# EAGLE design cvtv (EAGLE 6.6.0)
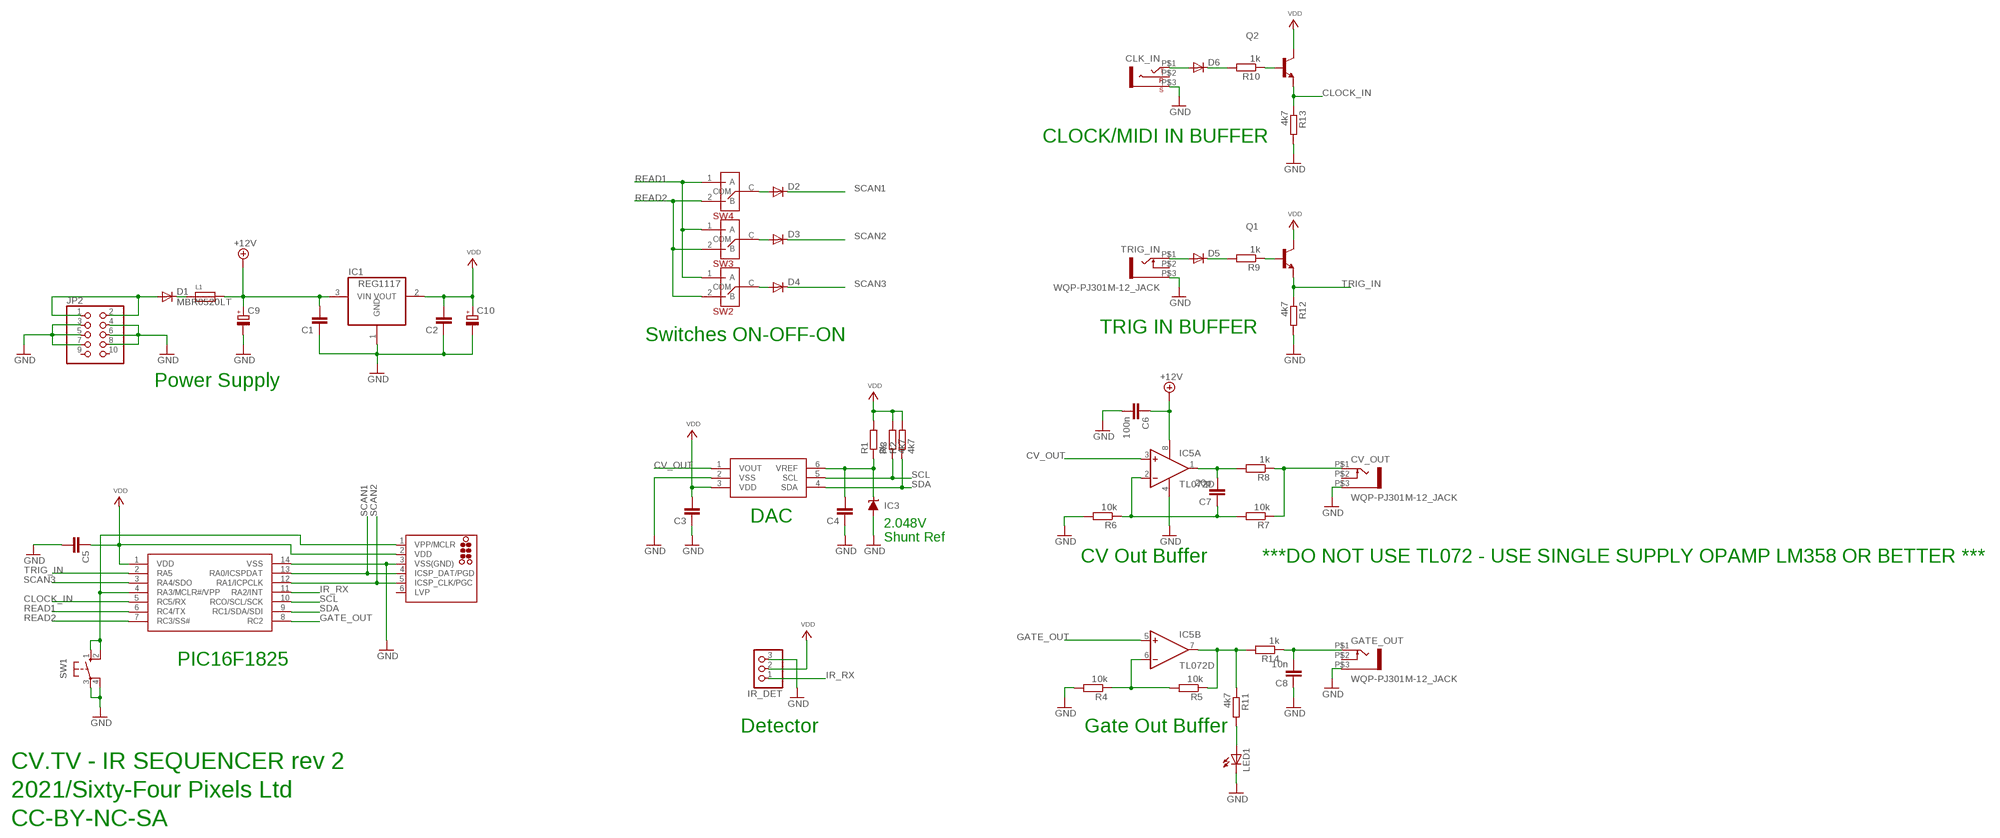
[diagram p0: schematic, sheet 1]

## Parts
C1  C-EUC0805  [C0805]
C2  C-EUC0805  [C0805]
C3  C-EUC0805  [C0805]
C4  C-EUC0805  [C0805]
C5  C-EUC0805  [C0805]
C6  100n  C-EUC0805  [C0805]
C7  20p  C-EUC0805  [C0805]
C8  10n  C-EUC0805  [C0805]
C9  CPOL-EUE2-5  [E2-5]
C10  CPOL-EUE2-5  [E2-5]
CLK_IN  THONKICONN_STEREO  [WQP-PJ301M-ST]
CV_OUT  WQP-PJ301M-12_JACK  [WQP-PJ301M-12_JACK]
D1  MBR0520LT  [SOD123]
D2  TS4148  [D0805]
D3  TS4148  [D0805]
D4  TS4148  [D0805]
D5  TS4148  [D0805]
D6  TS4148  [D0805]
GATE_OUT  WQP-PJ301M-12_JACK  [WQP-PJ301M-12_JACK]
IC1  REG1117  [SOT223]
IC2  PIC16F1825SO14  [SO14]
IC3  LM4041A12DBZ  [DBZ_R-PDSO-G3]
IC4  MCP4726  [SOT23-6]
IC5  TL072D  [SO08]
ICSP  TC2030-MCP-NL  [TC2030-MCP-NL]
IR_DET  PINHD-1X3  [1X03]
JP2  PINHD-2X5  [2X05]
L1  FERRITE  [0603]
LED1  LED3MM  [LED3MM]
Q1  MMBT3904LT1-NPN-SOT23-BEC  [SOT23-BEC]
Q2  MMBT3904LT1-NPN-SOT23-BEC  [SOT23-BEC]
R1  3k  R-EU_R0805  [R0805]
R2  4k7  R-EU_R0805  [R0805]
R3  4k7  R-EU_R0805  [R0805]
R4  10k  R-EU_R0805  [R0805]
R5  10k  R-EU_R0805  [R0805]
R6  10k  R-EU_R0805  [R0805]
R7  10k  R-EU_R0805  [R0805]
R8  1k  R-EU_R0805  [R0805]
R9  1k  R-EU_R0805  [R0805]
R10  1k  R-EU_R0805  [R0805]
R11  4k7  R-EU_R0805  [R0805]
R12  4k7  R-EU_R0805  [R0805]
R13  4k7  R-EU_R0805  [R0805]
R14  1k  R-EU_R0805  [R0805]
SW1  10-XX  [B3F-10XX]
SW2  MICRO-SPDT  [MICRO-SPDT]
SW3  MICRO-SPDT  [MICRO-SPDT]
SW4  MICRO-SPDT  [MICRO-SPDT]
TRIG_IN  WQP-PJ301M-12_JACK  [WQP-PJ301M-12_JACK]

## Nets
+12V: C1.2 C6.1 C9.+ IC1.3(VIN) IC5.8(P:V+) L1.2
CLOCK_IN: IC2.5(RC5/RX) Q2.E R13.1
CV_OUT: IC4.1(VOUT) IC5.3(A:+IN)
GATE_OUT: IC2.8(RC2) IC5.5(B:+IN)
GND: C1.1 C2.1 C3.1 C4.1 C5.2 C6.2 C8.1 C9.- C10.- CLK_IN.P$3(S) CV_OUT.P$3 GATE_OUT.P$3 IC1.1(GND) IC2.14(VSS) IC3.2(A) IC4.2(VSS) IC5.4(P:V-) ICSP.3(VSS(GND)) IR_DET.3 JP2.3 JP2.4 JP2.5 JP2.6 JP2.7 JP2.8 LED1.K(C) R4.2 R6.2 R12.2 R13.2 SW1.3(P) SW1.4(P1) TRIG_IN.P$3
IR_RX: IC2.11(RA2/INT) IR_DET.1
N$1: D1.A JP2.1 JP2.2
N$2: IC2.4(RA3/MCLR#/VPP) ICSP.1(VPP/MCLR) SW1.1(S) SW1.2(S1)
N$3: CLK_IN.P$1(T) D6.A
N$4: D1.C L1.1
N$5: LED1.A R11.2
N$6: C4.2 IC3.1(C) IC4.6(VREF) R1.1
N$7: D6.K(C) R10.2
N$9: Q2.B R10.1
N$10: D5.A TRIG_IN.P$1
N$11: D2.A SW4.C(COM)
N$12: D5.K(C) R9.2
N$13: IC5.7(B:OUT) R5.1 R11.1 R14.2
N$15: D3.A SW3.C(COM)
N$16: C8.2 GATE_OUT.P$1 R14.1
N$17: IC5.6(B:-IN) R4.1 R5.2
N$18: C7.1 IC5.2(A:-IN) R6.1 R7.2
N$19: CV_OUT.P$1 R7.1 R8.1
N$20: C7.2 IC5.1(A:OUT) R8.2
N$21: Q1.B R9.1
N$25: D4.A SW2.C(COM)
READ1: IC2.6(RC4/TX) SW2.1(A) SW3.1(A) SW4.1(A)
READ2: IC2.7(RC3/SS#) SW2.2(B) SW3.2(B) SW4.2(B)
SCAN1: D2.K(C) IC2.13(RA0/ICSPDAT) ICSP.4(ICSP_DAT/PGD)
SCAN2: D3.K(C) IC2.12(RA1/ICPCLK) ICSP.5(ICSP_CLK/PGC)
SCAN3: D4.K(C) IC2.3(RA4/SDO)
SCL: IC2.10(RCO/SCL/SCK) IC4.5(SCL) R3.1
SDA: IC2.9(RC1/SDA/SDI) IC4.4(SDA) R2.1
TRIG_IN: IC2.2(RA5) Q1.E R12.1
VDD: C2.2 C3.2 C5.1 C10.+ IC1.2(VOUT) IC2.1(VDD) IC4.3(VDD) ICSP.2(VDD) IR_DET.2 Q1.C Q2.C R1.2 R2.2 R3.2
Unconnected: CLK_IN.P$2(R) CV_OUT.P$2 GATE_OUT.P$2 ICSP.6(LVP) JP2.9 JP2.10 TRIG_IN.P$2

## Notes on the sheet
- CLOCK/MIDI IN BUFFER
- TRIG IN BUFFER
- Switches ON-OFF-ON
- Power Supply
- DAC
- 2.048V 
  Shunt Ref
- CV Out Buffer | ***DO NOT USE TL072 - USE SINGLE SUPPLY OPAMP LM358 OR BETTER ***
- PIC16F1825
- Detector | Gate Out Buffer
- CV.TV - IR SEQUENCER rev 2
- 2021/Sixty-Four Pixels Ltd
- CC-BY-NC-SA

## Library data of the parts
C1-C8 = resistor:C-EU: CAPACITOR, European symbol
C9 C10 = resistor:CPOL-EU: POLARIZED CAPACITOR, European symbol
CLK_IN = jason_eagle6:THONKICONN_STEREO
CV_OUT GATE_OUT TRIG_IN = thonkiconn:WQP-PJ301M-12_JACK
D1 = diode:MBR0520LT: SCHOTTKY BARRIER RECTIFIER Source: http://onsemi.com .. MBR0520LT1-D.pdf
D2-D6 = jason_eagle6:TS4148
IC1 = burr-brown:REG1117: 800mA and 1A Low Dropout (LDO) Positive Regulator 1.8V, 2.5V, 2.85V, 3.3V, 5V, and Adj; MPN: REG1117; OC_FARNELL: 1097566; OC_NEWARK: 14P6981
IC2 = jasons_stuff:PIC16F1825
IC3 = texas:LM4041: PRECISION MICROPOWER SHUNT VOLTAGE REFERENCE Source: http://focus.ti.com/lit/ds/slcs146e/slcs146e.pdf; MPN: LM4041A12IDBZR; OC_FARNELL: 1407949; OC_NEWARK: 58K5875
IC4 = jasons_stuff:MCP4726: I2C DAC 12BIT
IC5 = linear:TL072: OP AMP
ICSP = tag-connect:TC2030: TAG-CONNECT ICSP Connector Manufacturer: Tag-Connect <http://www.tag-connect.com> Cable for easy In-Circuit Serial Programming. Designed for Microchip ICD2, suitable for many others. Two variants - one "with legs" (for hands-free fit on PCB) and another "without legs" for quick programming. PAD Description 1 MCLR/Vpp 2 Vdd 3 GND 4 PGD (ISPDAT) 5 PGC (ISPCLK) 6 nc (used for LVP) ©2009 ROFA.cz - modified and updated by Robert Darlington ‹rdarlington@gmail.com›
IR_DET = pinhead:PINHD-1X3: PIN HEADER
JP2 = pinhead:PINHD-2X5: PIN HEADER
L1 = microbuilder:FERRITE: Ferrite Bead 0603 MMZ1608B121C - 120 Ohm, 600mA Ferrite Chip - Digikey: 445-2164-1-ND BK1608HW121-T - 120 Ohm, 600mA Ferrite Chip - Digikey: 587-1876-2-ND
LED1 = led:LED: LED OSRAM: - CHIPLED LG R971, LG N971, LY N971, LG Q971, LY Q971, LO R971, LY R971 LH N974, LH R974 LS Q976, LO Q976, LY Q976 LO Q996 - Hyper CHIPLED LW Q18S LB Q993, LB Q99A, LB R99A - SideLED LS A670, LO A670, LY A670, LG A670, LP A670 LB A673, LV A673, LT A673, LW A673 LH A674 LY A675 LS A676, LA A676, LO A676, LY A676, LW A676 LS A679, LY A679, LG A679 - Hyper Micro SIDELED® LS Y876, LA Y876, LO Y876, LY Y876 LT Y87S - SmartLED LW L88C, LW L88S LB L89C, LB L89S, LG L890 LS L89K, LO L89K, LY L89K LS L896, LA L896, LO L896, LY L896 - TOPLED LS T670, LO T670, LY T670, LG T670, LP T670 LSG T670, LSP T670, LSY T670, LOP T670, LYG T670 LG T671, LOG T671, LSG T671 LB T673, LV T673, LT T673, LW T673 LH T674 LS T676, LA T676, LO T676, LY T676, LB T676, LH T676, LSB T676, LW T676 LB T67C, LV T67C, LT T67C, LS T67K, LO T67K, LY T67K, LW E67C LS E67B, LA E67B, LO E67B, LY E67B, LB E67C, LV E67C, LT E67C LW T67C LS T679, LY T679, LG T679 LS T770, LO T770, LY T770, LG T770, LP T770 LB T773, LV T773, LT T773, LW T773 LH T774 LS E675, LA E675, LY E675, LS T675 LS T776, LA T776, LO T776, LY T776, LB T776 LHGB T686 LT T68C, LB T68C - Hyper Mini TOPLED® LB M676 - Mini TOPLED Santana® LG M470 LS M47K, LO M47K, LY M47K Source: http://www.osram.convergy.de LUXEON: - LUMILED® LXK2-PW12-R00, LXK2-PW12-S00, LXK2-PW14-U00, LXK2-PW14-V00 LXK2-PM12-R00, LXK2-PM12-S00, LXK2-PM14-U00 LXK2-PE12-Q00, LXK2-PE12-R00, LXK2-PE12-S00, LXK2-PE14-T00, LXK2-PE14-U00 LXK2-PB12-K00, LXK2-PB12-L00, LXK2-PB12-M00, LXK2-PB14-N00, LXK2-PB14-P00, LXK2-PB14-Q00 LXK2-PR12-L00, LXK2-PR12-M00, LXK2-PR14-Q00, LXK2-PR14-R00 LXK2-PD12-Q00, LXK2-PD12-R00, LXK2-PD12-S00 LXK2-PH12-R00, LXK2-PH12-S00 LXK2-PL12-P00, LXK2-PL12-Q00, LXK2-PL12-R00 Source: www.luxeon.com KINGBRIGHT: KA-3528ASYC Source: www.kingbright.com
Q1 Q2 = transistor-neu-to92:*-NPN-: NPN Transistror
R1-R14 = rcl:R-EU_: RESISTOR, European symbol
SW1 = switch-omron:10-XX: OMRON SWITCH; MPN: B3F-1000; OC_FARNELL: 176432; OC_NEWARK: 36M3542
SW2-SW4 = jason_eagle6:MICRO-SPDT

## Board
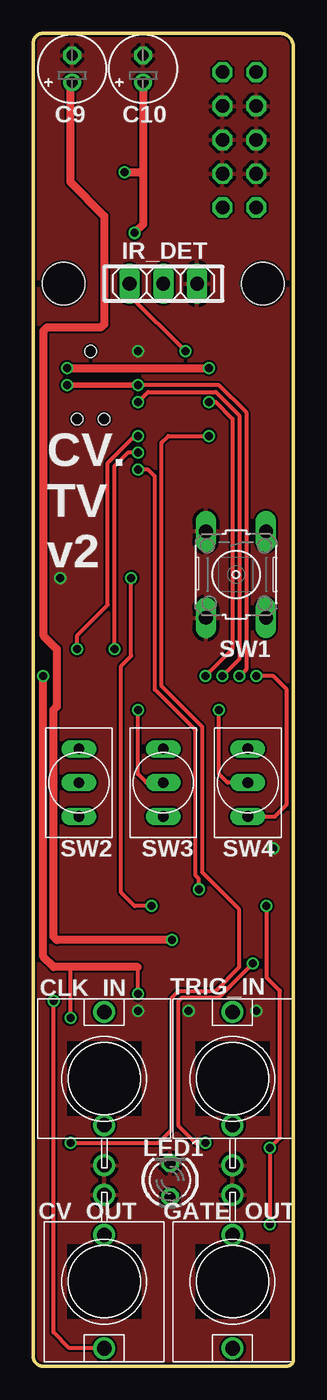
[diagram p1: board, top side]
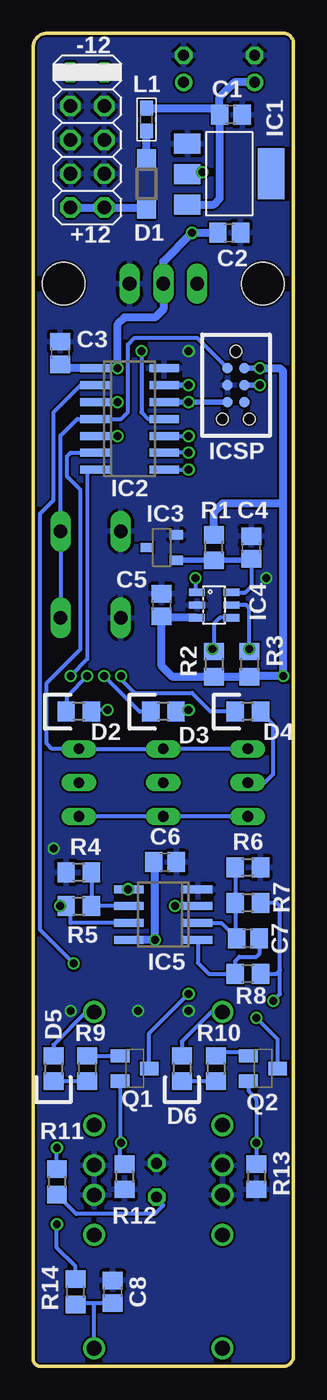
[diagram p2: board, bottom side, seen from below]

Size 19.56 x 100.08 mm. Coordinates in mm from the lower left corner, seen from the top.
Outline: 19.05,0 arc90 19.56,0.51 19.56,99.06 arc90 18.54,100.08 0.76,100.08 arc90 0,99.31 0,0.76 arc90 0.76,0 19.05,0
Copper layers (1*16): Top 0.035mm / dielectric 1.5mm / Bottom 0.035mm
Design rules "hackvana": minimum track width 6mil, minimum drill 0.3mm, track to track 6mil, track to pad 9mil, pad to pad 6mil, via to via 6mil, smd to smd 0mil, copper to edge 6mil, drill to drill 6mil, minimum pad ring 10mil, minimum via ring 6mil, stop-mask expansion 2mil, vias tented up to drill 100mil, thermal gap 10mil
Holes 3.2 mm at 17.27,81.28 2.29,81.28

### Footprints (pad centres in the part's own frame; a part is rotated, then mirrored left to right if it is on the bottom)
C0805 = smd 1.3 x 1.5: 1 -0.85,0; 2 0.85,0
E2-5 = drill 0.813 pad 1.27: + -1.016,0 | drill 0.813 pad 1.27 octagon: - 1.016,0
WQP-PJ301M-ST = drill 1.1: P$1 0,5; P$2 0,-3.5; P$3 0,-6.5
WQP-PJ301M-12_JACK = drill 1.1: P$1 0,5; P$2 0,-3.5; P$3 0,-6.5
SOD123 = smd 1.4 x 1.4: A 1.9,0; C -1.9,0
D0805 = smd 1.3 x 1.5: A -0.95,0; K 0.95,0
SOT223 = smd 1.499 x 2.007: 1 -2.261,-3.15; 2 0.025,-3.15; 3 2.311,-3.15 | smd 3.81 x 2.007: 4 0,3.15
SO14 = smd 0.6 x 2.2: 1 -3.81,-2.6; 2 -2.54,-2.6; 3 -1.27,-2.6; 4 0,-2.6; 5 1.27,-2.6; 6 2.54,-2.6; 7 3.81,-2.6; 8 3.81,2.6; 9 2.54,2.6; 10 1.27,2.6; 11 0,2.6; 12 -1.27,2.6; 13 -2.54,2.6; 14 -3.81,2.6
DBZ_R-PDSO-G3 = smd 0.7 x 1: 1 -0.95,-1.1; 2 0.95,-1.1; 3 0,1.1
SOT23-6 = smd 0.55 x 1.2: 1 -0.95,-1.3; 2 0,-1.3; 3 0.95,-1.3; 4 0.95,1.3; 5 0,1.3; 6 -0.95,1.3
SO08 = smd 0.6 x 2.2: 1 -1.905,-2.6; 2 -0.635,-2.6; 3 0.635,-2.6; 4 1.905,-2.6; 5 1.905,2.6; 6 0.635,2.6; 7 -0.635,2.6; 8 -1.905,2.6
TC2030-MCP-NL = smd 0.787 x 0.787: 1 1.27,-0.635; 2 1.27,0.635; 3 2.54,-0.635; 4 2.54,0.635; 5 3.81,-0.635; 6 3.81,0.635 | hole 0.889: 0,0; 5.08,-1.016; 5.08,1.016
1X03 = drill 1.016 long: 1 -2.54,0; 2 0,0; 3 2.54,0
2X05 = drill 1.016 octagon: 1 -5.08,-1.27; 2 -5.08,1.27; 3 -2.54,-1.27; 4 -2.54,1.27; 5 0,-1.27; 6 0,1.27; 7 2.54,-1.27; 8 2.54,1.27; 9 5.08,-1.27; 10 5.08,1.27
0603 = smd 1.1 x 1: 1 -0.85,0; 2 0.85,0
LED3MM = drill 0.813 octagon: A -1.27,0; K 1.27,0
SOT23-BEC = smd 1 x 1.4: B -0.95,-1.1; C 0,1.1; E 0.95,-1.1
R0805 = smd 1.3 x 1.5: 1 -0.95,0; 2 0.95,0
B3F-10XX = drill 1.016 long: 1 -3.251,2.261; 2 3.251,2.261; 3 -3.251,-2.261; 4 3.251,-2.261
MICRO-SPDT = drill 0.8 long: 1 0,2.54; 2 0,-2.54; C 0,0

### Placement (x,y rotation side)
C1  4.7,93.98 180 bottom
C2  4.83,85.09 180 bottom
C3  17.53,76.07 270 bottom
C4  3.17,61.47 270 bottom
C5  9.91,57.15 90 bottom
C6  9.65,37.85 0 bottom
C7  3.43,32.13 0 bottom
C8  13.59,5.59 270 bottom
C9  2.92,97.41 90 top
C10  8.25,97.41 90 top
CLK_IN  5.33,21.59 0 top
CV_OUT  5.33,6.35 180 top
D1  11.05,88.77 270 bottom
D2  16.13,49.15 180 bottom
D3  9.78,49.15 180 bottom
D4  3.43,49.15 180 bottom
D5  18.03,22.35 270 bottom
D6  8.38,22.35 270 bottom
GATE_OUT  14.99,6.35 180 top
IC1  4.83,89.53 270 bottom
IC2  12.32,71.12 270 bottom
IC3  9.91,61.47 90 bottom
IC4  5.97,57.15 270 bottom
IC5  9.78,33.91 90 bottom
ICSP  4.32,76.2 270 bottom
IR_DET  9.78,81.28 0 top
JP2  15.49,92.08 90 bottom
L1  11.05,93.6 90 bottom
LED1  10.29,13.97 90 top
Q1  11.94,22.35 270 bottom
Q2  2.29,22.35 270 bottom
R1  5.97,61.47 90 bottom
R2  5.97,52.7 270 bottom
R3  3.3,52.7 270 bottom
R4  16.13,37.08 180 bottom
R5  16.13,34.54 0 bottom
R6  3.43,37.47 0 bottom
R7  3.43,34.8 180 bottom
R8  3.43,29.46 180 bottom
R9  15.49,22.35 270 bottom
R10  5.84,22.35 270 bottom
R11  17.78,13.84 270 bottom
R12  12.7,14.22 270 bottom
R13  2.79,14.22 270 bottom
R14  16.38,5.59 90 bottom
SW1  15.24,59.44 270 top
SW2  3.43,43.81 0 top
SW3  9.78,43.81 0 top
SW4  16.13,43.81 0 top
TRIG_IN  14.99,21.59 0 top

### Tracks (layer width: path | path; a pad name or v marks a point on that pad's centre or on a via)
+12V  (via drill 0.6)
  Top 0.61: v10.41,32 1.78,32 1.52,32.26 1.52,49.28 1.78,49.53 1.78,53.85 0.76,54.86 0.76,77.72 1.02,77.98 5.08,77.98 5.33,78.23 5.33,86.36 2.79,88.9 2.79,96.27 C9.+
  Bottom 0.61: 10.41,38.1 C6.1 10.41,37.76 v10.41,32 IC5.8 | L1.2 6.02,94.45 C1.2 | C1.2 5.55,95.29 4.44,96.39 C9.+ | C1.2 5.55,87.67 5.99,87.22 IC1.3
CLOCK_IN  (via drill 0.6)
  Top 0.305: v13.21,69.85 10.16,69.85 9.65,69.34 9.65,51.05 12.7,48.01 12.7,37.08 15.49,34.29 15.49,29.97 13.72,28.19 10.92,28.19 10.41,27.69 10.41,17.78 9.4,16.76 v2.79,16.76
  Bottom 0.305: IC2.5 v13.21,69.85 | Q2.E 3.39,20.66 2.79,20.07 v2.79,16.76 2.79,16.51 R13.1
CV_OUT  (via drill 0.6)
  Top 0.305: v8.89,34.54 7.62,34.54 6.6,35.56 6.6,52.58 7.37,53.34 v7.37,59.18
  Bottom 0.305: IC5.3 v8.89,34.54 | v7.37,59.18 7.37,58.2 IC4.1
GATE_OUT  (via drill 0.6)
  Top 0.305: v12.45,35.81 12.45,36.58 12.19,36.83 12.19,47.75 9.14,50.8 9.14,66.8 8.64,67.31 v7.87,67.31
  Bottom 0.305: IC5.5 v12.45,35.81 | IC2.8 v7.87,67.31
GND  (via drill 0.6)
  other vias: 7.87,26.67 11.68,26.67 16.76,26.67 18.03,38.86 2.03,59.18 7.87,76.2
  pour Bottom: -2.29,102.87 -2.29,-1.27 21.84,-1.27 21.84,104.14 -2.29,104.14
  pour Top: -3.56,104.14 -3.56,-7.62 24.38,-7.62 24.38,105.41 -3.56,105.41
IR_RX  (via drill 0.6)
  Top 0.305: v11.43,76.2 7.24,80.39 IR_DET.1
  Bottom 0.305: v11.43,76.2 11.43,71.63 10.92,71.12 IC2.11
N$1
  Bottom 0.61: JP2.2 JP2.1 11.17,87 D1.A
N$2
  Bottom 0.305: ICSP.1 7.24,77.22 11.94,77.22 12.45,76.71 12.45,71.63 12.95,71.12 IC2.4 16.26,71.12 17.5,69.88 SW1.1 SW1.2
N$3
  Bottom 0.305: CLK_IN.P$1 6.18,26.59 8.38,24.38 D6.A
N$4
  Bottom 0.61: D1.C L1.1
N$5
  Bottom 0.305: LED1.A 9.78,12.06 10.41,11.43 16.32,11.43 R11.2
N$6
  Bottom 0.305: IC4.6 3.62,58.1 3.17,58.55 C4.2
  Bottom 0.406: IC3.1 R1.1 3.28,60.52 C4.2
N$7
  Bottom 0.305: R10.2 D6.K
N$9
  Bottom 0.305: Q2.B 3.88,23.56 5.84,23.56 R10.1
N$10
  Bottom 0.305: TRIG_IN.P$1 15.57,26.59 18.03,24.13 D5.A
N$11  (via drill 0.6)
  Top 0.305: SW4.C 14.61,43.81 13.97,44.45 v13.97,49.28
  Bottom 0.305: v13.97,49.28 15.05,49.28 D2.A
N$12
  Bottom 0.305: R9.2 D5.K
N$13  (via drill 0.6)
  Top 0.305: v17.78,10.67 v17.78,16.38 18.54,17.14 18.54,28.19 17.53,29.21 v17.53,34.54
  Bottom 0.305: R11.1 v17.78,16.38 | IC5.7 16.76,33.27 16.76,34.23 R5.1 v17.53,34.54 | R14.2 16.38,7.49 17.78,8.89 v17.78,10.67
N$15  (via drill 0.6)
  Top 0.305: SW3.C 8.51,43.81 7.87,44.45 v7.87,49.28
  Bottom 0.305: v7.87,49.28 8.7,49.28 D3.A
N$16
  Bottom 0.305: C8.2 14.99,4.74 | 14.99,4.74 16.03,4.74 R14.1 | GATE_OUT.P$1 14.99,4.74
N$17
  Bottom 0.305: IC5.6 R5.2 R4.1
N$18
  Bottom 0.305: R6.1 R7.2 4.38,32.23 C7.1 5.42,33.27 IC5.2
N$19  (via drill 0.6)
  Top 0.305: CV_OUT.P$1 2.71,1.35 1.52,2.54 v1.52,27.43
  Bottom 0.305: R8.1 1.27,29.46 1.02,29.72 | 1.02,29.72 1.02,34.54 1.27,34.8 R7.1 | 1.02,29.72 1.02,27.94 v1.52,27.43
N$20
  Bottom 0.305: C7.2 2.58,30.95 2.79,30.73 4.06,30.73 4.38,30.42 R8.2 6.35,29.46 7.18,30.29 IC5.1
N$21
  Bottom 0.305: R9.1 Q1.B
N$25
  Bottom 0.305: SW2.C 2.16,43.81 1.52,44.45 1.52,48.19 D4.A
READ1
  Bottom 0.305: SW2.1 SW3.1 SW4.1 18.16,46.35 18.54,46.74 18.54,51.31 16,53.85 16,65.79 17.02,66.8 17.02,68.33 16.76,68.58 IC2.6
READ2  (via drill 0.6)
  Top 0.305: SW4.2 18.16,41.27 19.05,42.16 19.05,50.8 18.03,51.82 v16.76,51.82
  Bottom 0.305: SW2.2 SW3.2 SW4.2 | IC2.7 15.49,67.31 | 15.75,67.31 15.49,67.31 | 15.49,67.31 15.49,53.09 v16.76,51.82
SCAN1  (via drill 0.6)
  Top 0.305: v7.87,73.66 13.97,73.66 16,71.63 16,52.32 v15.49,51.82
  Top 0.406: v7.87,73.66 v2.54,73.66
  Bottom 0.305: D2.K 17.02,49.21 17.02,50.29 v15.49,51.82
  Bottom 0.406: IC2.13 v7.87,73.66 | v2.54,73.66 ICSP.4
SCAN2  (via drill 0.6)
  Top 0.305: v7.87,72.39 8.64,73.15 13.72,73.15 15.49,71.37 15.49,53.09 v14.22,51.82
  Bottom 0.305: D3.K 11.56,49.15 v14.22,51.82
  Bottom 0.406: ICSP.5 v7.87,72.39 IC2.12
SCAN3  (via drill 0.6)
  Top 0.305: v12.95,51.82 14.99,53.85 14.99,71.12 13.72,72.39 v13.21,72.39
  Bottom 0.305: D4.K 6.22,49.15 7.62,50.55 11.94,50.55 12.95,51.56 v12.95,51.82 | IC2.3 v13.21,72.39
SCL  (via drill 0.6)
  Top 0.305: v3.3,53.85 3.3,54.86 5.59,57.15 5.59,67.82 7.62,69.85 v7.87,69.85
  Bottom 0.305: IC4.5 3.56,57.15 3.3,56.9 v3.3,53.85 R3.1 | IC2.10 v7.87,69.85
SDA  (via drill 0.6)
  Top 0.305: v6.1,53.85 6.1,67.56 7.11,68.58 v7.87,68.58
  Bottom 0.305: IC4.4 5.52,56.2 5.97,55.75 5.97,53.98 | R2.1 5.97,53.98 | 5.97,53.98 v6.1,53.85 | v7.87,68.58 IC2.9
TRIG_IN  (via drill 0.6)
  Top 0.305: v12.95,16.76 12.19,16.76 10.92,18.03 10.92,27.43 11.18,27.69 13.97,27.69 v16.51,30.23
  Bottom 0.305: IC2.2 16,73.66 18.03,71.63 18.03,65.02 19.05,64.01 19.05,32.77 v16.51,30.23 | Q1.E 13.04,16.68 | R12.1 13.04,15.51 13.04,16.68 | 13.04,16.68 v12.95,16.76
VDD  (via drill 0.6)
  Top 0.305: v2.79,26.16 2.79,29.97 | v7.87,27.94 7.87,29.97
  Top 0.61: 7.87,29.97 2.79,29.97 1.52,29.97 0.76,30.73 v0.76,51.82 | v2.54,74.93 v13.21,74.93 | C10.+ 8.25,89.41 | 8.25,89.41 8.25,85.72 v7.62,85.09 | v6.86,89.66 8,89.66 8.25,89.41
  Bottom 0.305: v2.79,26.16 1.19,24.55 Q2.C | Q1.C 10.84,24.98 v7.87,27.94
  Bottom 0.406: ICSP.2 v2.54,74.93
  Bottom 0.61: IC4.3 9.81,56.2 C5.1 9.91,52.58 9.08,51.76 R2.2 4.06,51.76 | R3.2 4.06,51.76 | 4.06,51.76 4,51.82 v0.76,51.82 0.76,64.77 | 0.76,64.77 0.76,74.68 1.02,74.93 v2.54,74.93 | 0.76,64.77 5.33,64.77 5.97,64.14 R1.2 | C2.2 v7.62,85.09 9.78,82.93 IR_DET.2 9.78,79.38 10.41,78.74 12.7,78.74 13.21,78.23 v13.21,74.93 IC2.1 17.23,74.93 C3.2 | IC1.2 7.01,89.51 v6.86,89.66

### Text on the board
tPlace: CV. / TV / v2
bPlace: -12 | +12